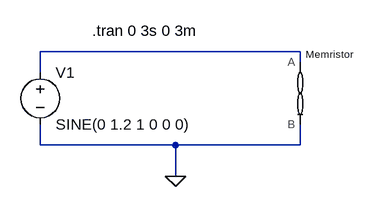
[diagram p0: schematic memristor_sim.asc]
memristor_sim.asc, the LTspice schematic file:
Version 4
SHEET 1 880 680
WIRE 416 0 16 0
WIRE 416 16 416 0
WIRE 16 32 16 0
WIRE 16 144 16 112
WIRE 224 144 16 144
WIRE 416 144 416 112
WIRE 416 144 224 144
WIRE 224 192 224 144
FLAG 224 192 0
SYMBOL memristor 416 64 R0
SYMATTR InstName Memristor
SYMBOL voltage 16 16 R0
WINDOW 123 0 0 Left 2
WINDOW 39 0 0 Left 2
SYMATTR InstName V1
SYMATTR Value SINE(0 1.2 1 0 0 0)
TEXT 96 -32 Left 2 !.tran 0 3s 0 3m

The netlist it stands for:
* memristor_sim.asc
XMemristor N001 0 memristor  ; pins A B
V1 N001 0 SINE(0 1.2 1 0 0 0)
.tran 0 3s 0 3m
.lib memristor.sub
.backanno
.end